# Altium schematic sheet RP2040.SchDoc: MoonPilot - RP2040
size A3; DrawnBy: Máni Magnússon; Revision: A; SheetNumber: 2
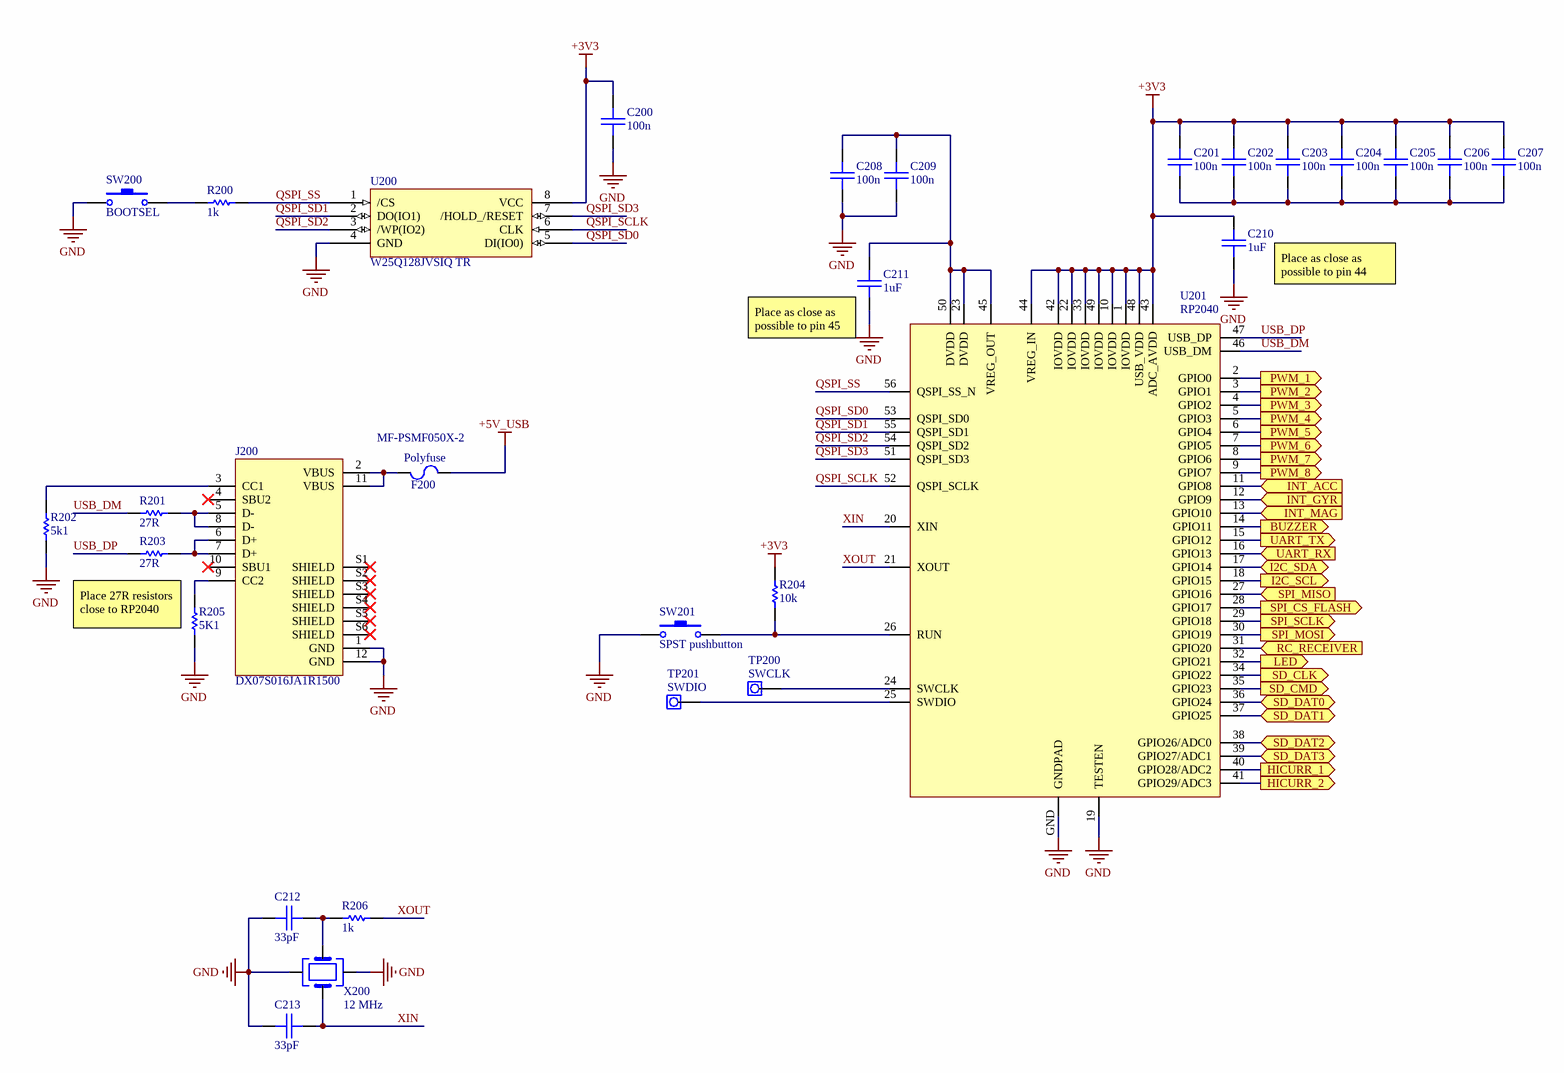
[diagram p0: RP2040.SchDoc]

## Parts
C200  100n  [0603_CAP]
C201  100n  [0603_CAP]
C202  100n  [0603_CAP]
C203  100n  [0603_CAP]
C204  100n  [0603_CAP]
C205  100n  [0603_CAP]
C206  100n  [0603_CAP]
C207  100n  [0603_CAP]
C208  100n  [0603_CAP]
C209  100n  [0603_CAP]
C210  1uF  [0603_CAP]
C211  1uF  [0603_CAP]
C212  33pF  [0603_CAP]
C213  33pF  [0603_CAP]
F200  Polyfuse  [0805]
J200  DX07S016JA1R1500  [JAE_DX07S016JA1R1500]
R200  1k  [0603_RES]
R201  27R  [0603_RES]
R202  5k1  [0603_RES]
R203  27R  [0603_RES]
R204  10k  [0805_RES]
R205  5K1  [0603_RES]
R206  1k  [0603_RES]
SW200  BOOTSEL  [TL1015]
SW201  SPST pushbutton  [TL1015]
TP200  SWCLK  [Testpoint]
TP201  SWDIO  [Testpoint]
U200  W25Q128JVSIQ TR  [SOIC_208MIL_WIN]
U201  RP2040  [RP2040]
X200  12 MHz  [XOSC_3.2mmx2.5mm]

## Ports
BUZZER (out), HICURR_1 (out), HICURR_2 (out), I2C_SCL (out), I2C_SDA (bidir), INT_ACC (in), INT_GYR (in), INT_MAG (in), LED (out), PWM_1 (out), PWM_2 (out), PWM_3 (out), PWM_4 (out), PWM_5 (out), PWM_6 (out), PWM_7 (out), PWM_8 (out), RC_RECEIVER (in), SD_CLK (out), SD_CMD (out), SD_DAT0 (bidir), SD_DAT1 (bidir), SD_DAT2 (bidir), SD_DAT3 (bidir), SPI_CS_FLASH (out), SPI_MISO (in), SPI_MOSI (out), SPI_SCLK (out), UART_RX (in), UART_TX (out)

## Nets
+3V3: C200.1 C201.1 C202.1 C203.1 C204.1 C205.1 C206.1 C207.1 C210.1 R204.1 U200.8(VCC) U201.1(IOVDD) U201.10(IOVDD) U201.22(IOVDD) U201.33(IOVDD) U201.42(IOVDD) U201.43(ADC_AVDD) U201.44(VREG_IN) U201.48(USB_VDD) U201.49(IOVDD)
+5V_USB: F200.2
GND: C200.2 C208.2 C209.2 C210.2 C211.2 C212.2 C213.2 J200.1(GND) J200.12(GND) R202.2 R205.2 SW200.1 SW201.1 U200.4(GND) U201.19(TESTEN) U201.GND(GNDPAD) X200.2 X200.4
BUZZER: U201.14(GPIO11) ; port BUZZER
HICURR_1: U201.40(GPIO28/ADC2) ; port HICURR_1
HICURR_2: U201.41(GPIO29/ADC3) ; port HICURR_2
I2C_SCL: U201.18(GPIO15) ; port I2C_SCL
I2C_SDA: U201.17(GPIO14) ; port I2C_SDA
INT_ACC: U201.11(GPIO8) ; port INT_ACC
INT_GYR: U201.12(GPIO9) ; port INT_GYR
INT_MAG: U201.13(GPIO10) ; port INT_MAG
LED: U201.32(GPIO21) ; port LED
PWM_1: U201.2(GPIO0) ; port PWM_1
PWM_2: U201.3(GPIO1) ; port PWM_2
PWM_3: U201.4(GPIO2) ; port PWM_3
PWM_4: U201.5(GPIO3) ; port PWM_4
PWM_5: U201.6(GPIO4) ; port PWM_5
PWM_6: U201.7(GPIO5) ; port PWM_6
PWM_7: U201.8(GPIO6) ; port PWM_7
PWM_8: U201.9(GPIO7) ; port PWM_8
QSPI_SCLK: U200.6(CLK) U201.52(QSPI_SCLK)
QSPI_SD0: U200.5(DI(IO0)) U201.53(QSPI_SD0)
QSPI_SD1: U200.2(DO(IO1)) U201.55(QSPI_SD1)
QSPI_SD2: U200.3(/WP(IO2)) U201.54(QSPI_SD2)
QSPI_SD3: U200.7(/HOLD_/RESET) U201.51(QSPI_SD3)
QSPI_SS: R200.2 U200.1(/CS) U201.56(QSPI_SS_N)
RC_RECEIVER: U201.31(GPIO20) ; port RC_RECEIVER
SD_CLK: U201.34(GPIO22) ; port SD_CLK
SD_CMD: U201.35(GPIO23) ; port SD_CMD
SD_DAT0: U201.36(GPIO24) ; port SD_DAT0
SD_DAT1: U201.37(GPIO25) ; port SD_DAT1
SD_DAT2: U201.38(GPIO26/ADC0) ; port SD_DAT2
SD_DAT3: U201.39(GPIO27/ADC1) ; port SD_DAT3
SPI_CS_FLASH: U201.28(GPIO17) ; port SPI_CS_FLASH
SPI_MISO: U201.27(GPIO16) ; port SPI_MISO
SPI_MOSI: U201.30(GPIO19) ; port SPI_MOSI
SPI_SCLK: U201.29(GPIO18) ; port SPI_SCLK
UART_RX: U201.16(GPIO13) ; port UART_RX
UART_TX: U201.15(GPIO12) ; port UART_TX
USB_DM: R201.1 U201.46(USB_DM)
USB_DP: R203.1 U201.47(USB_DP)
XIN: C213.1 U201.20(XIN) X200.1
XOUT: R206.1 U201.21(XOUT)
NetC201_2: C201.2 C202.2 C203.2 C204.2 C205.2 C206.2 C207.2
NetC208_1: C208.1 C209.1 C211.1 U201.23(DVDD) U201.45(VREG_OUT) U201.50(DVDD)
NetC212_1: C212.1 R206.2 X200.3
NetF200_1: F200.1 J200.2(VBUS) J200.11(VBUS)
NetJ200_3: J200.3(CC1) R202.1
NetJ200_5: J200.5(D-) J200.8(D-) R201.2
NetJ200_6: J200.6(D+) J200.7(D+) R203.2
NetJ200_9: J200.9(CC2) R205.1
NetR200_1: R200.1 SW200.2
NetR204_2: R204.2 SW201.2 U201.26(RUN)
NetTP200_1: TP200.1 U201.24(SWCLK)
NetTP201_1: TP201.1 U201.25(SWDIO)

Not connected (* = marked no-connect by the designer): J200 4(SBU2)* 10(SBU1)* S1(SHIELD)* S2(SHIELD)* S3(SHIELD)* S4(SHIELD)* S5(SHIELD)* S6(SHIELD)*

## Notes on the sheet
- (near C210) Place as close as possible to pin 44
- (near C211) Place as close as possible to pin 45
- MF-PSMF050X-2
- (near R205) Place 27R resistors close to RP2040
- Sheet title:
- Revision:
- Drawn by:
- Date:
- File:

## Library data of the parts
C200-C213 = Capacitor
F200 = Fuse
J200 = DX07S016JA1R1500: USB 2.0 Type C Receptacle Dip Type, PCB Top Mount (Digikey part no. 670-DX07S016JA1R1500CT-ND); MF: JAE Electronics; Value: *; Price: None; Package: None; Availability: Unavailable; MP: DX07S016JA1R1500; DigiKey-Purchase-URL: https://snapeda.com/shop?store=DigiKey&id=4551013; SnapEDA_Link: https://www.snapeda.com/parts/DX07S016JA1R1500/JAE%20Electronics/view-part/4551013/?ref=snap
R200-R206 = Resistor
SW200 SW201 = PushButton: DigiKey part no. EG4344CT-ND
TP200 TP201 = Testpoint
U200 = W25Q128JVSIQ TR: No Description Available; Vendor: Winbond; Built_By: EMA_Cory; SourceLibrary: Winbond_2020-02-06; Datasheet: https://www.winbond.com/resource-files/w25q128jv%20revf%2003272018%20plus.pdf; Manufacturer_Part_Number: W25Q128JVSIQ TR; Copyright: Copyright (C) 2018 Accelerated Designs. All rights reserved; RefDes: RefDes; Type: DEV
X200 = XTAL_12 MHz: 12 MHz crystal oscillator / ECS-120-20-33-CKM-TR / DigiKey part no. XC1810CT-ND; ComponentLink1Description: DigiKey; ComponentLink1URL: https://www.digikey.com/en/products/detail/ecs-inc/ECS-120-20-33-CKM-TR/2781815; DigiKey: XC1810CT-ND